# EAGLE schematic sevseg_driver (EAGLE 7.2.0)
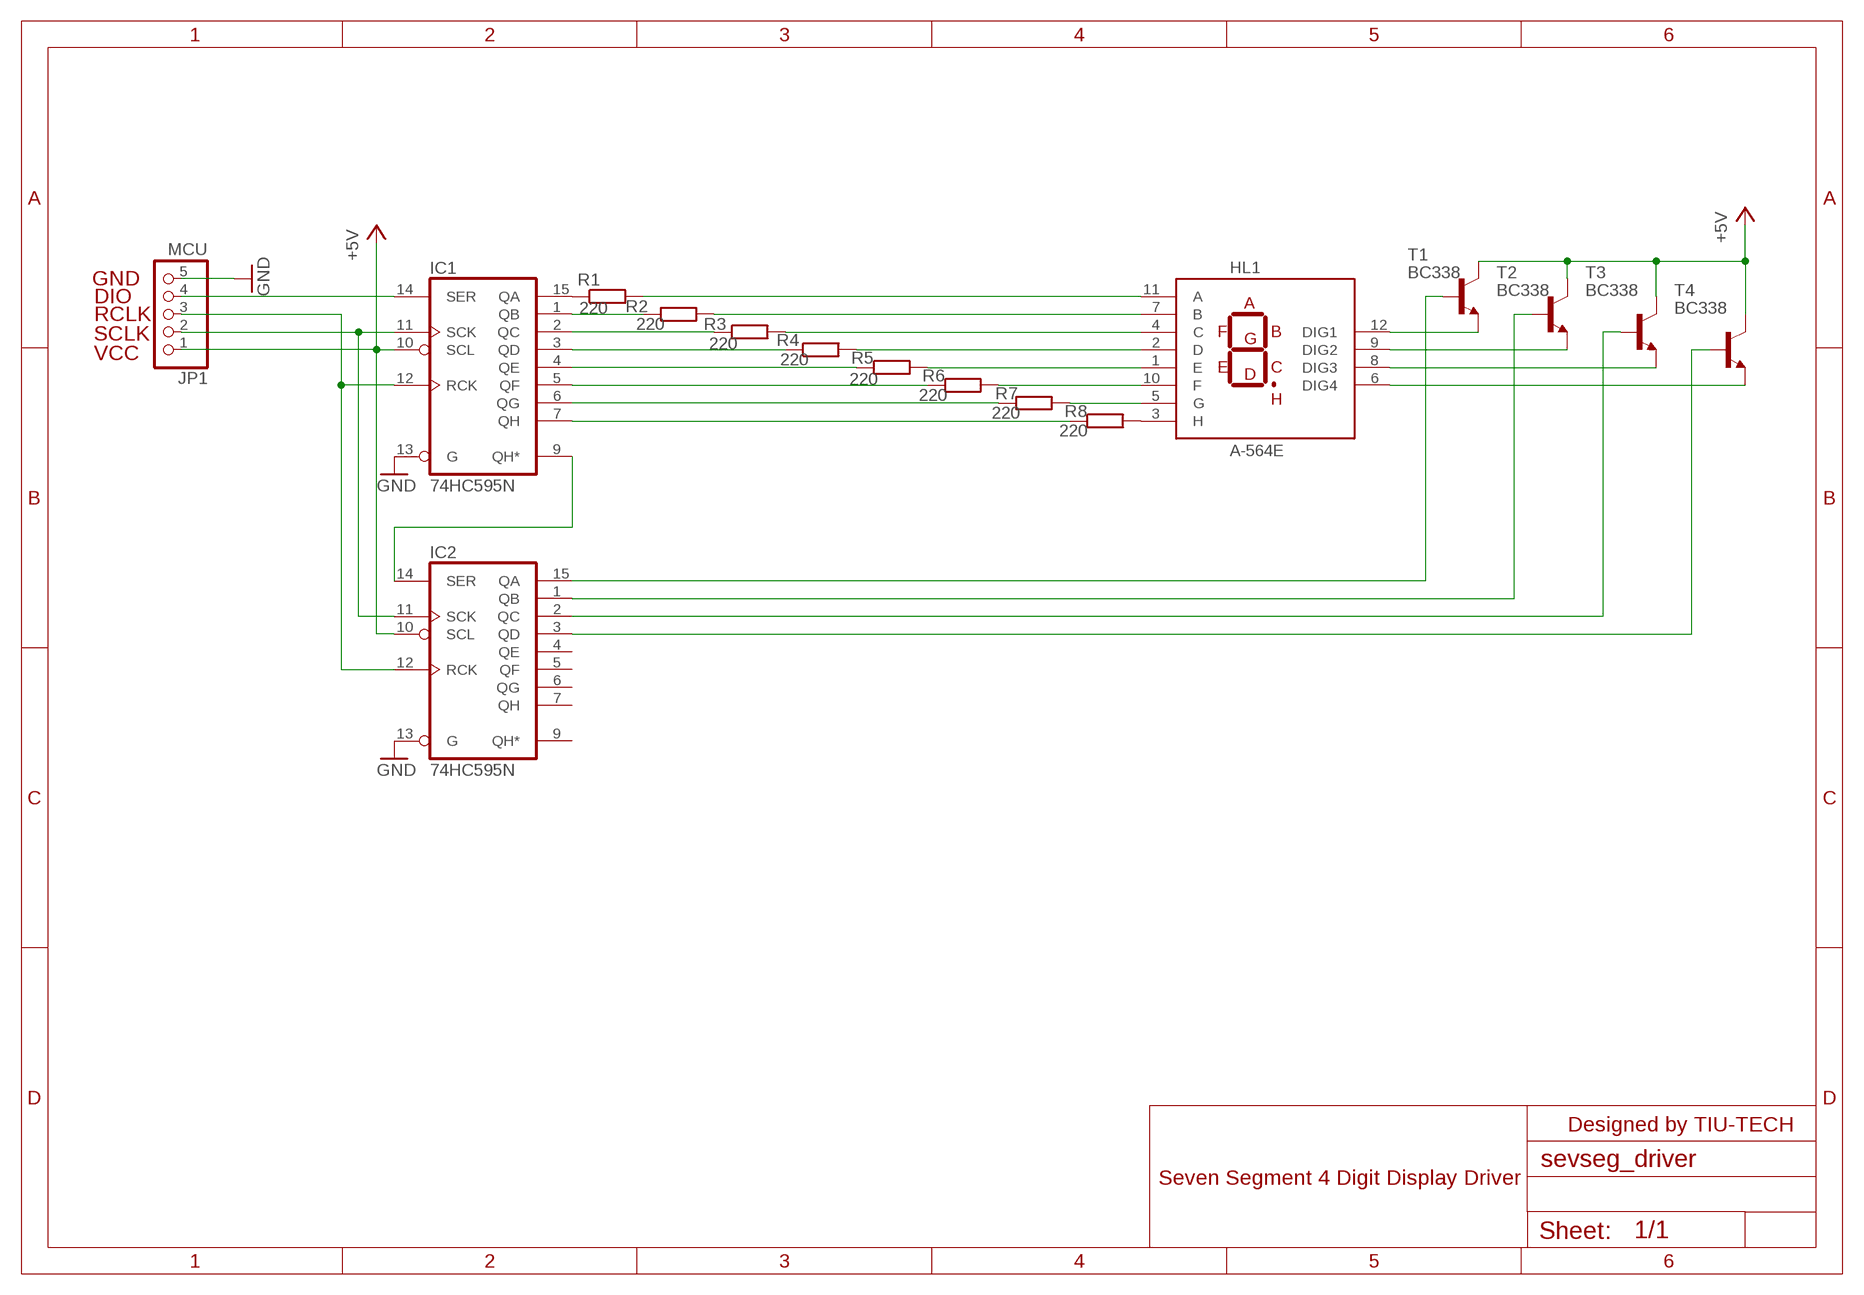
[diagram p0: schematic, sheet 1]

## Parts
HL1  A-564E  [C/A-564]
IC1  74HC595N  [DIL16]
IC2  74HC595N  [DIL16]
JP1  MCU  PINHD-1X5  [1X05]
R1  220  R-EU_0204/7  [0204/7]
R2  220  R-EU_0204/7  [0204/7]
R3  220  R-EU_0204/7  [0204/7]
R4  220  R-EU_0204/7  [0204/7]
R5  220  R-EU_0204/7  [0204/7]
R6  220  R-EU_0204/7  [0204/7]
R7  220  R-EU_0204/7  [0204/7]
R8  220  R-EU_0204/7  [0204/7]
T1  BC338  [TO92-EBC]
T2  BC338  [TO92-EBC]
T3  BC338  [TO92-EBC]
T4  BC338  [TO92-EBC]

## Nets
GND: IC1.13(G) IC2.13(G) JP1.5
N$1: IC1.15(QA) R1.1
N$2: HL1.3(H) R8.2
N$3: HL1.11(A) R1.2
N$4: IC1.1(QB) R2.1
N$5: HL1.7(B) R2.2
N$6: HL1.4(C) R3.2
N$7: IC1.2(QC) R3.1
N$8: IC1.3(QD) R4.1
N$9: IC1.9(QH*) IC2.14(SER)
N$10: HL1.12(DIG1) T1.E
N$11: HL1.9(DIG2) T2.E
N$12: HL1.8(DIG3) T3.E
N$13: HL1.6(DIG4) T4.E
N$14: IC1.14(SER) JP1.4
N$15: HL1.2(D) R4.2
N$16: HL1.1(E) R5.2
N$17: IC1.4(QE) R5.1
N$18: IC1.5(QF) R6.1
N$19: HL1.10(F) R6.2
N$20: HL1.5(G) R7.2
N$21: IC1.6(QG) R7.1
N$22: IC1.7(QH) R8.1
N$23: IC2.15(QA) T1.B
N$24: IC2.1(QB) T2.B
N$25: IC2.2(QC) T3.B
N$26: IC2.3(QD) T4.B
N$27: IC1.12(RCK) IC2.12(RCK) JP1.3
N$28: IC1.11(SCK) IC2.11(SCK) JP1.2
VCC: IC1.10(SCL) IC2.10(SCL) JP1.1 T1.C T2.C T3.C T4.C ; supply symbol labelled +5V
Unconnected: IC2.4(QE) IC2.5(QF) IC2.6(QG) IC2.7(QH) IC2.9(QH*)

## Notes on the sheet
- GND
- DIO
- RCLK
- SCLK
- VCC
- Designed by TIU-TECH
- Seven Segment 4 Digit Display Driver

## Power pins joined to a net without a drawn wire
GND: IC1.8(GND) IC2.8(GND)
VCC: IC1.16(VCC) IC2.16(VCC)

## Library data of the parts
HL1 = led-seg:A-564: Para Light A-564x Four digits 7seg display Common anode. 50x19 mm place. 14.22mm (560 mil) digit height CA56-21GWA compatible 2009 Draw by Ivan A-R <http://tuxotronic.org>. License CC-BY-SA 3.0 <http://creativecommons.org/licenses/by-sa/3.0/>
IC1 IC2 = 74xx-eu:74*595: 8-bit SHIFT REGISTER, output latch
JP1 = pinhead:PINHD-1X5: PIN HEADER
R1-R8 = resistor:R-EU_: RESISTOR, European symbol
T1-T4 = transistor-npn:BC338*: NPN Transistor